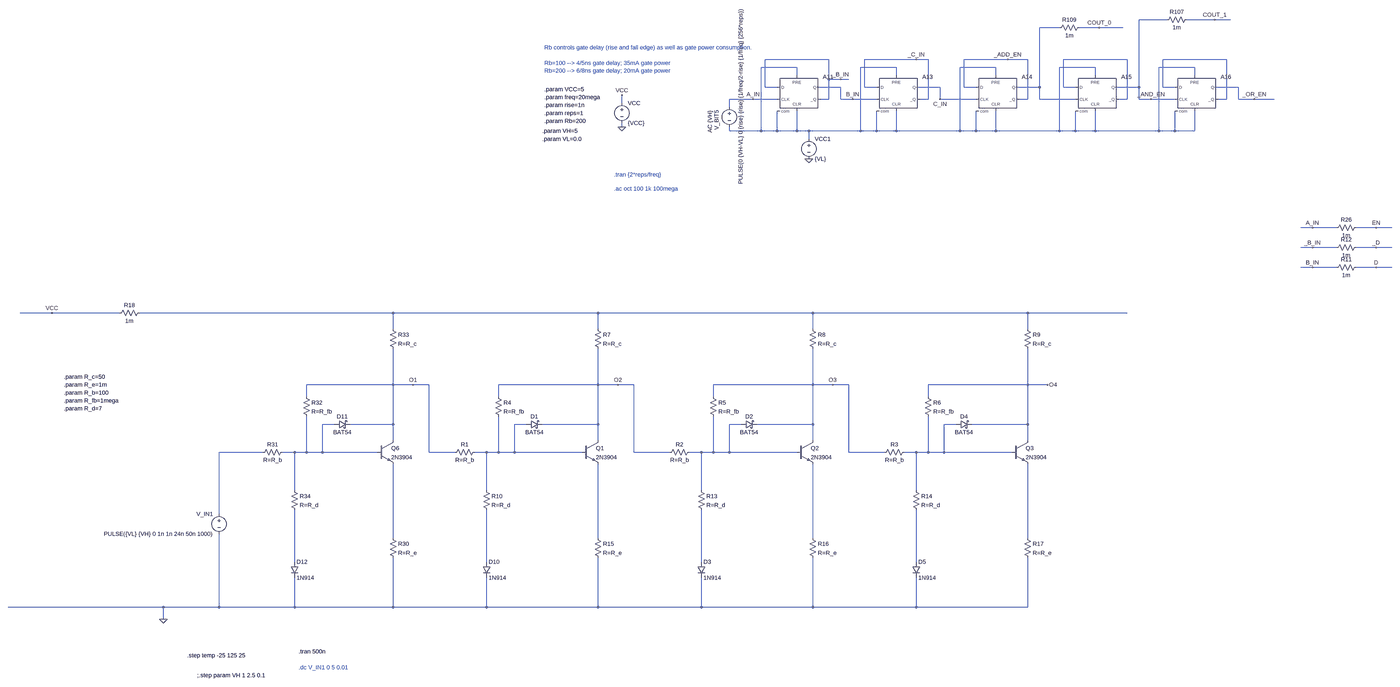
[diagram p0: schematic low_power_inverter.asc, whole sheet]
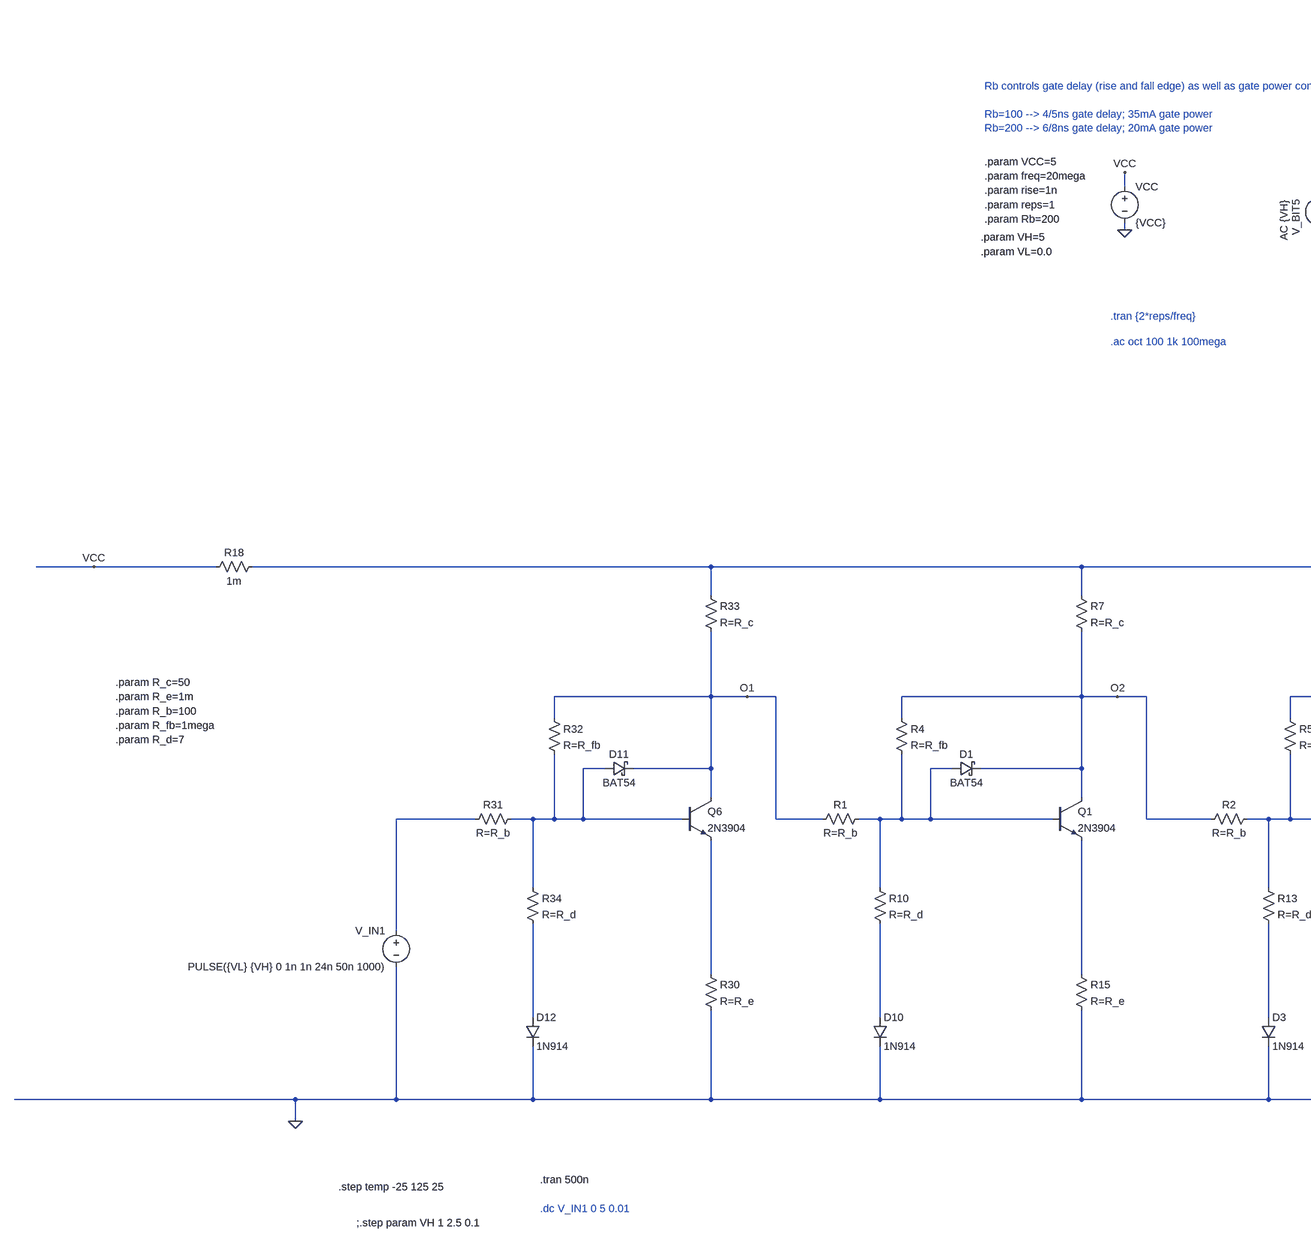
[diagram p1: schematic low_power_inverter.asc, part, row 1 of 1, column 1 of 2]
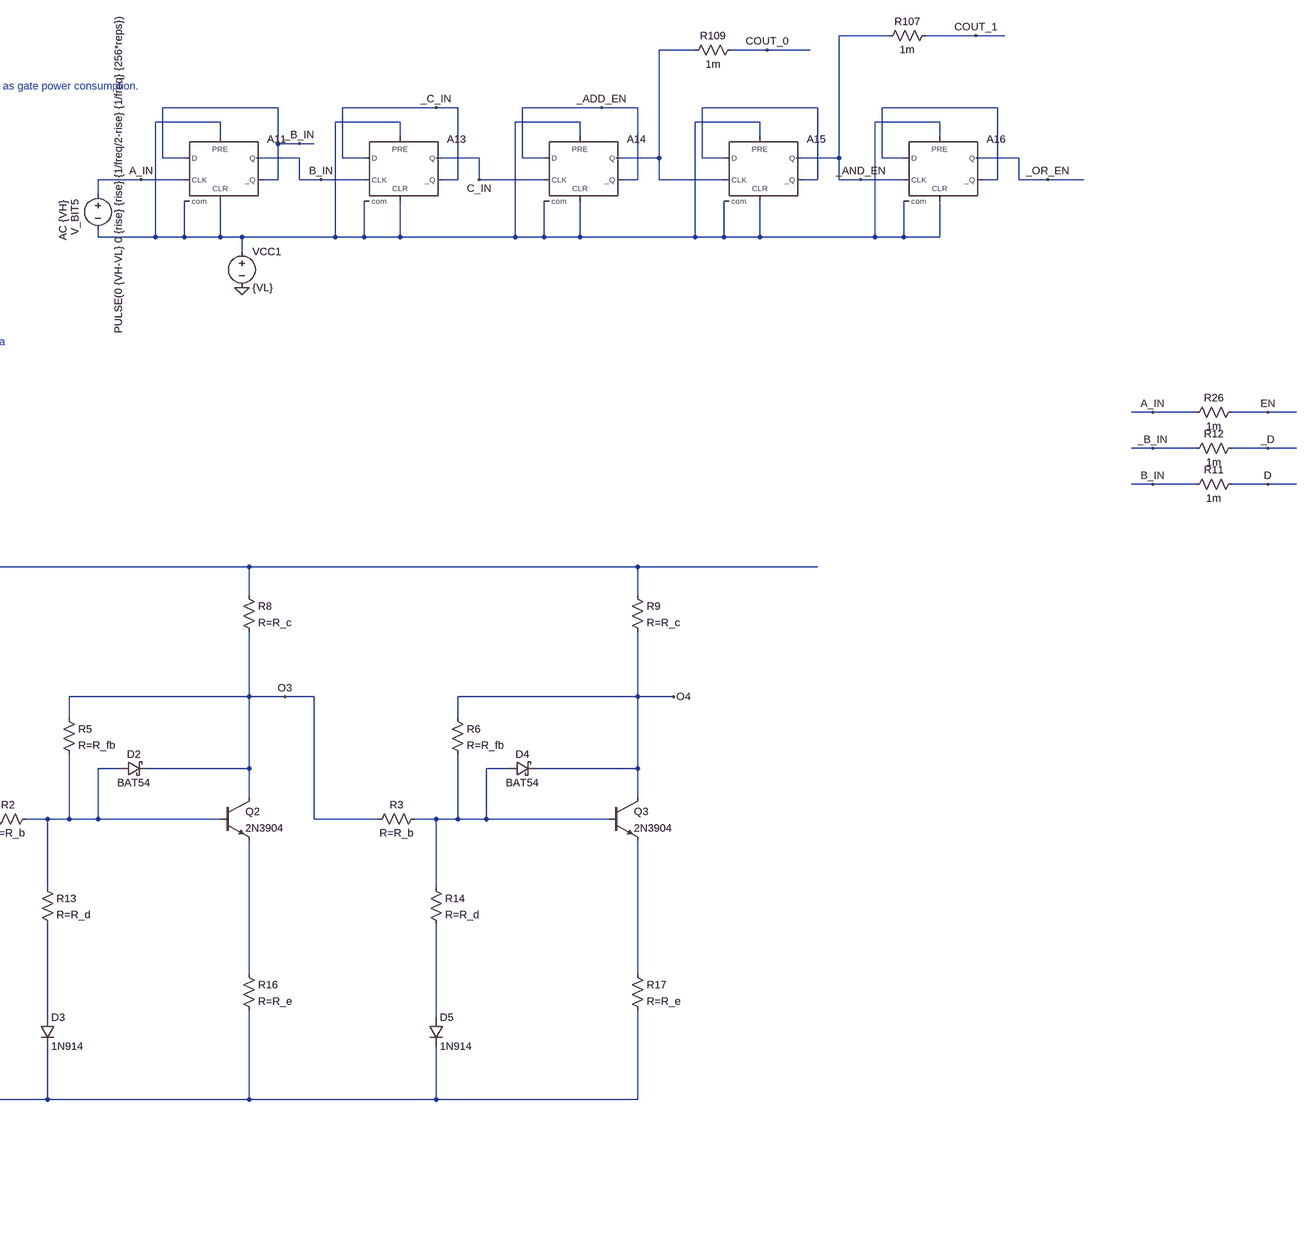
[diagram p2: schematic low_power_inverter.asc, part, row 1 of 1, column 2 of 2]
low_power_inverter.asc, the LTspice schematic file:
Version 4
SHEET 1 20052 9880
WIRE 1392 1344 1280 1344
WIRE 1584 1344 1472 1344
WIRE 1648 1344 1584 1344
WIRE 960 1376 880 1376
WIRE 1120 1376 1040 1376
WIRE 1216 1376 1120 1376
WIRE 32 1504 -224 1504
WIRE 384 1504 176 1504
WIRE 432 1504 384 1504
WIRE 752 1504 576 1504
WIRE 832 1504 752 1504
WIRE 1232 1504 976 1504
WIRE 1632 1504 1376 1504
WIRE -96 1536 -240 1536
WIRE 304 1536 160 1536
WIRE 704 1536 560 1536
WIRE 1104 1536 960 1536
WIRE 1504 1536 1360 1536
WIRE -96 1568 -96 1536
WIRE 304 1568 304 1536
WIRE 704 1568 704 1536
WIRE 1104 1568 1104 1536
WIRE 1504 1568 1504 1536
WIRE 32 1584 32 1504
WIRE 80 1584 32 1584
WIRE 112 1584 80 1584
WIRE -224 1616 -224 1504
WIRE -176 1616 -224 1616
WIRE 80 1616 -16 1616
WIRE 176 1616 176 1504
WIRE 224 1616 176 1616
WIRE 480 1616 384 1616
WIRE 576 1616 576 1504
WIRE 624 1616 576 1616
WIRE 880 1616 880 1376
WIRE 880 1616 784 1616
WIRE 976 1616 976 1504
WIRE 1024 1616 976 1616
WIRE 1280 1616 1280 1344
WIRE 1280 1616 1184 1616
WIRE 1376 1616 1376 1504
WIRE 1424 1616 1376 1616
WIRE 1680 1616 1584 1616
WIRE -272 1664 -368 1664
WIRE -176 1664 -272 1664
WIRE 32 1664 32 1584
WIRE 32 1664 0 1664
WIRE 80 1664 80 1616
WIRE 128 1664 80 1664
WIRE 224 1664 128 1664
WIRE 432 1664 432 1504
WIRE 432 1664 400 1664
WIRE 480 1664 480 1616
WIRE 624 1664 480 1664
WIRE 832 1664 832 1504
WIRE 832 1664 800 1664
WIRE 880 1664 880 1616
WIRE 1024 1664 880 1664
WIRE 1232 1664 1232 1504
WIRE 1232 1664 1200 1664
WIRE 1280 1664 1280 1616
WIRE 1328 1664 1280 1664
WIRE 1424 1664 1328 1664
WIRE 1632 1664 1632 1504
WIRE 1632 1664 1600 1664
WIRE 1680 1664 1680 1616
WIRE 1744 1664 1680 1664
WIRE 1824 1664 1744 1664
WIRE -800 1680 -800 1648
WIRE -368 1696 -368 1664
WIRE -800 1776 -800 1760
WIRE -368 1792 -368 1776
WIRE -240 1792 -240 1536
WIRE -240 1792 -368 1792
WIRE -176 1792 -176 1712
WIRE -176 1792 -240 1792
WIRE -96 1792 -96 1712
WIRE -96 1792 -176 1792
WIRE -48 1792 -96 1792
WIRE 160 1792 160 1536
WIRE 160 1792 -48 1792
WIRE 224 1792 224 1712
WIRE 224 1792 160 1792
WIRE 304 1792 304 1712
WIRE 304 1792 224 1792
WIRE 560 1792 560 1536
WIRE 560 1792 304 1792
WIRE 624 1792 624 1712
WIRE 624 1792 560 1792
WIRE 704 1792 704 1712
WIRE 704 1792 624 1792
WIRE 960 1792 960 1536
WIRE 960 1792 704 1792
WIRE 1024 1792 1024 1712
WIRE 1024 1792 960 1792
WIRE 1104 1792 1104 1712
WIRE 1104 1792 1024 1792
WIRE 1360 1792 1360 1536
WIRE 1360 1792 1104 1792
WIRE 1424 1792 1424 1712
WIRE 1424 1792 1360 1792
WIRE 1504 1792 1504 1712
WIRE 1504 1792 1424 1792
WIRE -48 1824 -48 1792
WIRE 2176 2608 2128 2608
WIRE 2272 2608 2176 2608
WIRE 2432 2608 2352 2608
WIRE 2496 2608 2432 2608
WIRE 2176 2688 2128 2688
WIRE 2272 2688 2176 2688
WIRE 2432 2688 2352 2688
WIRE 2496 2688 2432 2688
WIRE 2176 2768 2128 2768
WIRE 2272 2768 2176 2768
WIRE 2432 2768 2352 2768
WIRE 2496 2768 2432 2768
WIRE -3184 3280 -3808 3280
WIRE -2912 3280 -3184 3280
WIRE -1760 3280 -2832 3280
WIRE -896 3280 -1760 3280
WIRE -32 3280 -896 3280
WIRE 832 3280 -32 3280
WIRE 1232 3280 832 3280
WIRE -1760 3344 -1760 3280
WIRE -896 3344 -896 3280
WIRE -32 3344 -32 3280
WIRE 832 3344 832 3280
WIRE -1760 3632 -1760 3424
WIRE -1760 3632 -2160 3632
WIRE -1680 3632 -1760 3632
WIRE -1616 3632 -1680 3632
WIRE -896 3632 -896 3424
WIRE -896 3632 -1296 3632
WIRE -816 3632 -896 3632
WIRE -752 3632 -816 3632
WIRE -32 3632 -32 3424
WIRE -32 3632 -432 3632
WIRE 48 3632 -32 3632
WIRE 112 3632 48 3632
WIRE 832 3632 832 3424
WIRE 832 3632 432 3632
WIRE 912 3632 832 3632
WIRE -2160 3680 -2160 3632
WIRE -1296 3680 -1296 3632
WIRE -432 3680 -432 3632
WIRE 432 3680 432 3632
WIRE -2048 3792 -2096 3792
WIRE -1760 3792 -1760 3632
WIRE -1760 3792 -1984 3792
WIRE -1184 3792 -1232 3792
WIRE -896 3792 -896 3632
WIRE -896 3792 -1120 3792
WIRE -320 3792 -368 3792
WIRE -32 3792 -32 3632
WIRE -32 3792 -256 3792
WIRE 544 3792 496 3792
WIRE 832 3792 832 3632
WIRE 832 3792 608 3792
WIRE -1760 3856 -1760 3792
WIRE -896 3856 -896 3792
WIRE -32 3856 -32 3792
WIRE 832 3856 832 3792
WIRE -2336 3904 -2512 3904
WIRE -2208 3904 -2256 3904
WIRE -2160 3904 -2160 3760
WIRE -2160 3904 -2208 3904
WIRE -2096 3904 -2096 3792
WIRE -2096 3904 -2160 3904
WIRE -1824 3904 -2096 3904
WIRE -1616 3904 -1616 3632
WIRE -1472 3904 -1616 3904
WIRE -1344 3904 -1392 3904
WIRE -1296 3904 -1296 3760
WIRE -1296 3904 -1344 3904
WIRE -1232 3904 -1232 3792
WIRE -1232 3904 -1296 3904
WIRE -960 3904 -1232 3904
WIRE -752 3904 -752 3632
WIRE -608 3904 -752 3904
WIRE -480 3904 -528 3904
WIRE -432 3904 -432 3760
WIRE -432 3904 -480 3904
WIRE -368 3904 -368 3792
WIRE -368 3904 -432 3904
WIRE -96 3904 -368 3904
WIRE 112 3904 112 3632
WIRE 256 3904 112 3904
WIRE 384 3904 336 3904
WIRE 432 3904 432 3760
WIRE 432 3904 384 3904
WIRE 496 3904 496 3792
WIRE 496 3904 432 3904
WIRE 768 3904 496 3904
WIRE -2208 4112 -2208 3904
WIRE -1344 4112 -1344 3904
WIRE -480 4112 -480 3904
WIRE 384 4112 384 3904
WIRE -2512 4208 -2512 3904
WIRE -1760 4304 -1760 3952
WIRE -896 4304 -896 3952
WIRE -32 4304 -32 3952
WIRE 832 4304 832 3952
WIRE -2208 4400 -2208 4192
WIRE -1344 4400 -1344 4192
WIRE -480 4400 -480 4192
WIRE 384 4400 384 4192
WIRE -2736 4736 -3856 4736
WIRE -2512 4736 -2512 4288
WIRE -2512 4736 -2736 4736
WIRE -2208 4736 -2208 4464
WIRE -2208 4736 -2512 4736
WIRE -1760 4736 -1760 4384
WIRE -1760 4736 -2208 4736
WIRE -1344 4736 -1344 4464
WIRE -1344 4736 -1760 4736
WIRE -896 4736 -896 4384
WIRE -896 4736 -1344 4736
WIRE -480 4736 -480 4464
WIRE -480 4736 -896 4736
WIRE -32 4736 -32 4384
WIRE -32 4736 -480 4736
WIRE 384 4736 384 4464
WIRE 384 4736 -32 4736
WIRE 832 4736 832 4384
WIRE 832 4736 384 4736
WIRE -2736 4784 -2736 4736
FLAG -800 1776 0
FLAG -800 1648 VCC
FLAG -272 1664 A_IN
FLAG 128 1664 B_IN
FLAG 480 1664 C_IN
FLAG 752 1504 _ADD_EN
FLAG 1328 1664 _AND_EN
FLAG 1744 1664 _OR_EN
FLAG 1120 1376 COUT_0
FLAG 1584 1344 COUT_1
FLAG 80 1584 _B_IN
FLAG 2432 2608 EN
FLAG 2432 2688 _D
FLAG 2432 2768 D
FLAG 2176 2608 A_IN
FLAG 2176 2688 _B_IN
FLAG 2176 2768 B_IN
FLAG 384 1504 _C_IN
FLAG -48 1904 0
FLAG -1680 3632 O1
FLAG -2736 4784 0
FLAG -3184 3280 VCC
FLAG -816 3632 O2
FLAG 48 3632 O3
FLAG 912 3632 O4
SYMBOL voltage -800 1664 R0
WINDOW 123 0 0 Left 0
WINDOW 39 0 0 Left 0
SYMATTR InstName VCC
SYMATTR Value {VCC}
SYMBOL voltage -368 1680 R0
WINDOW 123 -77 30 VRight 2
WINDOW 39 0 0 Left 0
WINDOW 0 -51 28 VRight 2
WINDOW 3 46 -379 VRight 2
SYMATTR Value2 AC {VH}
SYMATTR InstName V_BIT5
SYMATTR Value PULSE(0 {VH-VL} 0 {rise} {rise} {1/freq/2-rise} {1/freq} {256*reps})
SYMBOL Digital\\dflop -96 1568 R0
SYMATTR SpiceLine Vhigh={VH-VL}
SYMATTR InstName A11
SYMBOL Digital\\dflop 304 1568 R0
SYMATTR SpiceLine Vhigh={VH-VL}
SYMATTR InstName A13
SYMBOL Digital\\dflop 1104 1568 R0
SYMATTR SpiceLine Vhigh={VH-VL}
SYMATTR InstName A15
SYMBOL Digital\\dflop 1504 1568 R0
SYMATTR SpiceLine Vhigh={VH-VL}
SYMATTR InstName A16
SYMBOL Digital\\dflop 704 1568 R0
SYMATTR SpiceLine Vhigh={VH-VL}
SYMATTR InstName A14
SYMBOL res 1488 1328 R90
WINDOW 0 0 56 VBottom 2
WINDOW 3 32 56 VTop 2
SYMATTR InstName R107
SYMATTR Value 1m
SYMBOL res 1056 1360 R90
WINDOW 0 0 56 VBottom 2
WINDOW 3 32 56 VTop 2
SYMATTR InstName R109
SYMATTR Value 1m
SYMBOL res 2256 2784 R270
WINDOW 0 32 56 VTop 2
WINDOW 3 0 56 VBottom 2
SYMATTR InstName R11
SYMATTR Value 1m
SYMBOL res 2256 2704 R270
WINDOW 0 32 56 VTop 2
WINDOW 3 0 56 VBottom 2
SYMATTR InstName R12
SYMATTR Value 1m
SYMBOL res 2256 2624 R270
WINDOW 0 32 56 VTop 2
WINDOW 3 0 56 VBottom 2
SYMATTR InstName R26
SYMATTR Value 1m
SYMBOL voltage -2512 4192 M0
WINDOW 123 0 0 Left 0
WINDOW 39 0 0 Left 0
SYMATTR InstName V_IN1
SYMATTR Value PULSE({VL} {VH} 0 1n 1n 24n 50n 1000)
SYMBOL voltage -48 1808 R0
WINDOW 123 0 0 Left 0
WINDOW 39 0 0 Left 0
SYMATTR InstName VCC1
SYMATTR Value {VL}
SYMBOL npn -960 3856 R0
SYMATTR InstName Q1
SYMATTR Value 2N3904
SYMBOL schottky -1184 3808 R270
WINDOW 0 32 32 VTop 2
WINDOW 3 0 32 VBottom 2
SYMATTR InstName D1
SYMATTR Value BAT54
SYMATTR Description Diode
SYMATTR Type diode
SYMBOL diode -1360 4400 R0
SYMATTR InstName D10
SYMATTR Value 1N914
SYMBOL npn -1824 3856 R0
SYMATTR InstName Q6
SYMATTR Value 2N3904
SYMBOL res -1776 4288 R0
SYMATTR InstName R30
SYMATTR Value R=R_e
SYMBOL res -2352 3920 R270
WINDOW 0 32 56 VTop 2
WINDOW 3 0 56 VBottom 2
SYMATTR InstName R31
SYMATTR Value R=R_b
SYMBOL schottky -2048 3808 R270
WINDOW 0 32 32 VTop 2
WINDOW 3 0 32 VBottom 2
SYMATTR InstName D11
SYMATTR Value BAT54
SYMATTR Description Diode
SYMATTR Type diode
SYMBOL res -2176 3664 R0
SYMATTR InstName R32
SYMATTR Value R=R_fb
SYMBOL res -1776 3328 R0
SYMATTR InstName R33
SYMATTR Value R=R_c
SYMBOL res -2224 4096 R0
SYMATTR InstName R34
SYMATTR Value R=R_d
SYMBOL diode -2224 4400 R0
SYMATTR InstName D12
SYMATTR Value 1N914
SYMBOL npn -96 3856 R0
SYMATTR InstName Q2
SYMATTR Value 2N3904
SYMBOL schottky -320 3808 R270
WINDOW 0 32 32 VTop 2
WINDOW 3 0 32 VBottom 2
SYMATTR InstName D2
SYMATTR Value BAT54
SYMATTR Description Diode
SYMATTR Type diode
SYMBOL diode -496 4400 R0
SYMATTR InstName D3
SYMATTR Value 1N914
SYMBOL npn 768 3856 R0
SYMATTR InstName Q3
SYMATTR Value 2N3904
SYMBOL schottky 544 3808 R270
WINDOW 0 32 32 VTop 2
WINDOW 3 0 32 VBottom 2
SYMATTR InstName D4
SYMATTR Value BAT54
SYMATTR Description Diode
SYMATTR Type diode
SYMBOL diode 368 4400 R0
SYMATTR InstName D5
SYMATTR Value 1N914
SYMBOL res -1488 3920 R270
WINDOW 0 32 56 VTop 2
WINDOW 3 0 56 VBottom 2
SYMATTR InstName R1
SYMATTR Value R=R_b
SYMBOL res -624 3920 R270
WINDOW 0 32 56 VTop 2
WINDOW 3 0 56 VBottom 2
SYMATTR InstName R2
SYMATTR Value R=R_b
SYMBOL res 240 3920 R270
WINDOW 0 32 56 VTop 2
WINDOW 3 0 56 VBottom 2
SYMATTR InstName R3
SYMATTR Value R=R_b
SYMBOL res -1312 3664 R0
SYMATTR InstName R4
SYMATTR Value R=R_fb
SYMBOL res -448 3664 R0
SYMATTR InstName R5
SYMATTR Value R=R_fb
SYMBOL res 416 3664 R0
SYMATTR InstName R6
SYMATTR Value R=R_fb
SYMBOL res -912 3328 R0
SYMATTR InstName R7
SYMATTR Value R=R_c
SYMBOL res -48 3328 R0
SYMATTR InstName R8
SYMATTR Value R=R_c
SYMBOL res 816 3328 R0
SYMATTR InstName R9
SYMATTR Value R=R_c
SYMBOL res -1360 4096 R0
SYMATTR InstName R10
SYMATTR Value R=R_d
SYMBOL res -496 4096 R0
SYMATTR InstName R13
SYMATTR Value R=R_d
SYMBOL res 368 4096 R0
SYMATTR InstName R14
SYMATTR Value R=R_d
SYMBOL res -912 4288 R0
SYMATTR InstName R15
SYMATTR Value R=R_e
SYMBOL res -48 4288 R0
SYMATTR InstName R16
SYMATTR Value R=R_e
SYMBOL res 816 4288 R0
SYMATTR InstName R17
SYMATTR Value R=R_e
SYMBOL res -2816 3264 R90
WINDOW 0 0 56 VBottom 2
WINDOW 3 32 56 VTop 2
SYMATTR InstName R18
SYMATTR Value 1m
TEXT -832 1968 Left 2 ;.tran {2*reps/freq}
TEXT -832 2024 Left 2 ;.ac oct 100 1k 100mega
TEXT -1112 1624 Left 2 !.param VCC=5
TEXT -1112 1656 Left 2 !.param freq=20mega
TEXT -1112 1688 Left 2 !.param rise=1n
TEXT -1112 1720 Left 2 !.param reps=1
TEXT -1112 1752 Left 2 !.param Rb=200
TEXT -1112 1456 Left 2 ;Rb controls gate delay (rise and fall edge) as well as gate power consumption.\n \nRb=100 --> 4/5ns gate delay; 35mA gate power\nRb=200 --> 6/8ns gate delay; 20mA gate power
TEXT -2192 5040 Left 2 ;.dc V_IN1 0 5 0.01
TEXT -2192 4976 Left 2 !.tran 500n
TEXT -2640 4992 Left 2 !.step temp -25 125 25
TEXT -2600 5072 Left 2 !;.step param VH 1 2.5 0.1
TEXT -1120 1792 Left 2 !.param VH=5
TEXT -1120 1824 Left 2 !.param VL=0.0
TEXT -3136 3600 Left 2 !.param R_c=50
TEXT -3136 3632 Left 2 !.param R_e=1m
TEXT -3136 3664 Left 2 !.param R_b=100
TEXT -3136 3696 Left 2 !.param R_fb=1mega
TEXT -3136 3728 Left 2 !.param R_d=7

The netlist it stands for:
* low_power_inverter.asc
VCC VCC 0 {VCC}
V_BIT5 A_IN N004 PULSE(0 {VH-VL} 0 {rise} {rise} {1/freq/2-rise} {1/freq} {256*reps}) AC {VH}
A11 _B_IN N004 A_IN N004 N004 _B_IN B_IN N004 DFLOP Vhigh={VH-VL}
A13 _C_IN N004 B_IN N004 N004 _C_IN C_IN N004 DFLOP Vhigh={VH-VL}
A15 N002 N004 N001 N004 N004 N002 _AND_EN N004 DFLOP Vhigh={VH-VL}
A16 N003 N004 _AND_EN N004 N004 N003 _OR_EN N004 DFLOP Vhigh={VH-VL}
A14 _ADD_EN N004 C_IN N004 N004 _ADD_EN N001 N004 DFLOP Vhigh={VH-VL}
R107 COUT_1 _AND_EN 1m
R109 COUT_0 N001 1m
R11 B_IN D 1m
R12 _B_IN _D 1m
R26 A_IN EN 1m
V_IN1 N010 0 PULSE({VL} {VH} 0 1n 1n 24n 50n 1000)
VCC1 N004 0 {VL}
Q1 O2 N007 N012 0 2N3904
D1 N007 O2 BAT54
D10 N016 0 1N914
Q6 O1 N006 N011 0 2N3904
R30 N011 0 R=R_e
R31 N010 N006 R=R_b
D11 N006 O1 BAT54
R32 O1 N006 R=R_fb
R33 N005 O1 R=R_c
R34 N006 N015 R=R_d
D12 N015 0 1N914
Q2 O3 N008 N013 0 2N3904
D2 N008 O3 BAT54
D3 N017 0 1N914
Q3 O4 N009 N014 0 2N3904
D4 N009 O4 BAT54
D5 N018 0 1N914
R1 O1 N007 R=R_b
R2 O2 N008 R=R_b
R3 O3 N009 R=R_b
R4 O2 N007 R=R_fb
R5 O3 N008 R=R_fb
R6 O4 N009 R=R_fb
R7 N005 O2 R=R_c
R8 N005 O3 R=R_c
R9 N005 O4 R=R_c
R10 N007 N016 R=R_d
R13 N008 N017 R=R_d
R14 N009 N018 R=R_d
R15 N012 0 R=R_e
R16 N013 0 R=R_e
R17 N014 0 R=R_e
R18 N005 VCC 1m
.model D D
.lib standard.dio
.model NPN NPN
.model PNP PNP
.lib standard.bjt
* .tran {2*reps/freq}
* .ac oct 100 1k 100mega
.param VCC=5
.param freq=20mega
.param rise=1n
.param reps=1
.param Rb=200
* Rb controls gate delay (rise and fall edge) as well as gate power consumption.
* Rb=100 --> 4/5ns gate delay; 35mA gate power
* Rb=200 --> 6/8ns gate delay; 20mA gate power
* .dc V_IN1 0 5 0.01
.tran 500n
.step temp -25 125 25
;.step param VH 1 2.5 0.1
.param VH=5
.param VL=0.0
.param R_c=50
.param R_e=1m
.param R_b=100
.param R_fb=1mega
.param R_d=7
.backanno
.end